# Altium schematic sheet PERIPHERALS.SchDoc: PERIPHERALS
size A3; Author: NGUYEN QUANG MINH; SheetNumber: 5; SheetTotal: 5; ProjectTitle: Arduino_DIY_V1.0
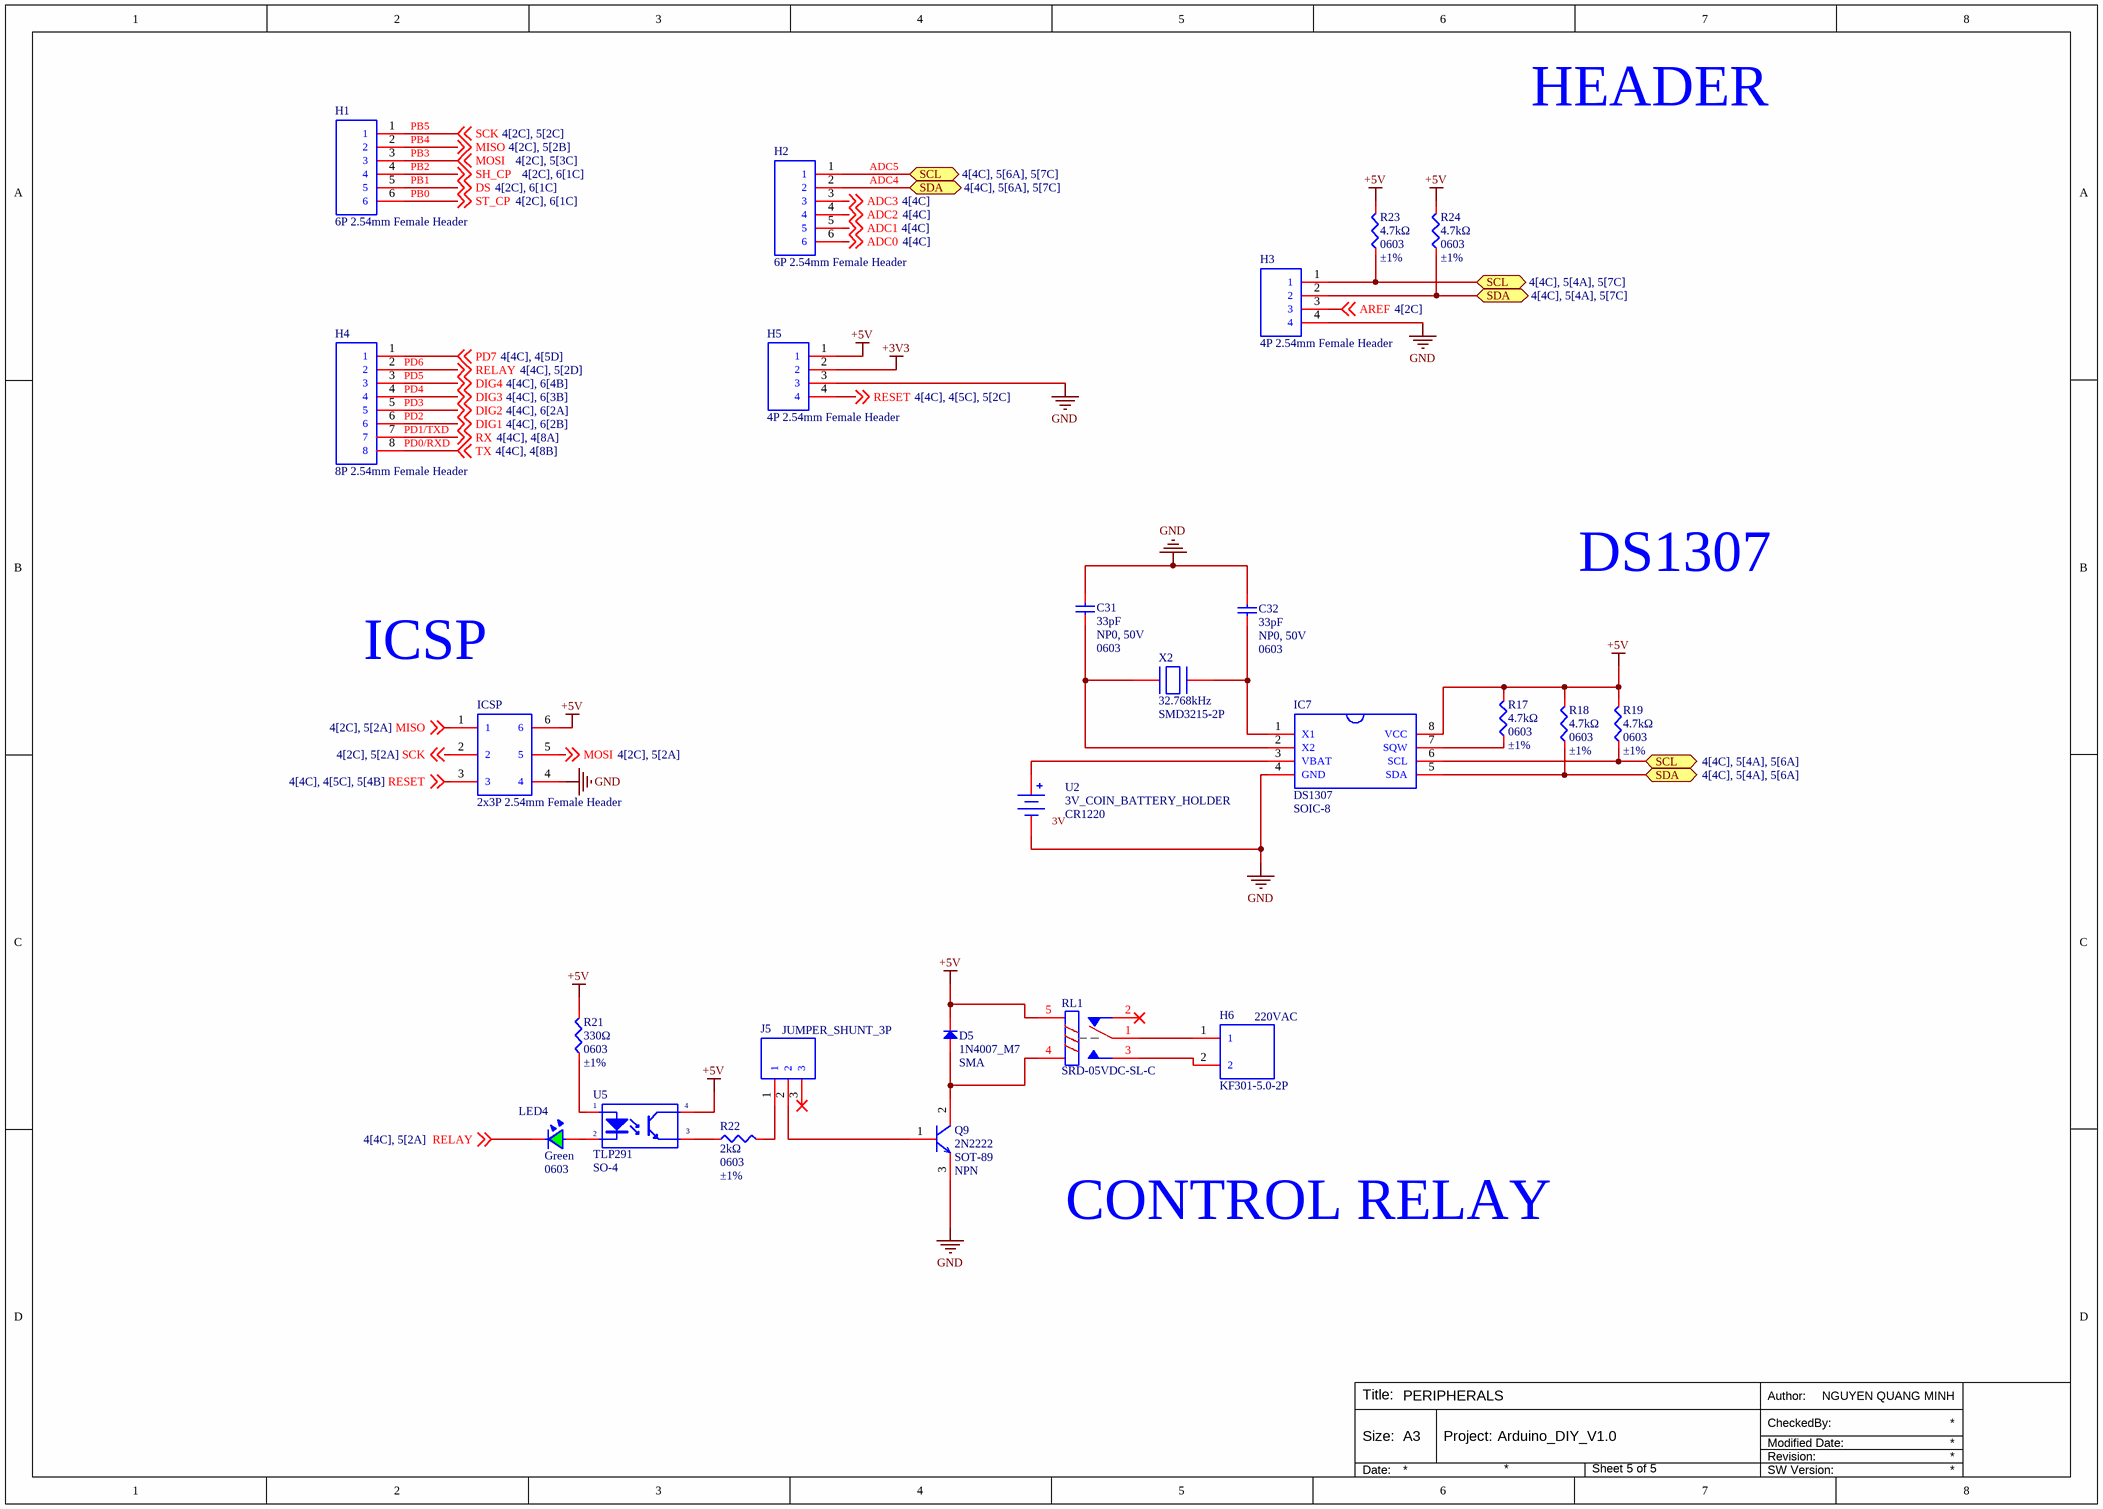
[diagram p0: PERIPHERALS.SchDoc]

## Parts
C31  33pF  Temperature Coefficient: NP0, 50V  Package: 0603  [C0603]
C32  33pF  Temperature Coefficient: NP0, 50V  Package: 0603  [C0603]
D5  1N4007_M7  Package: SMA  [SMA(DO-214AC)]
H1  6P 2.54mm Female Header  [6P, 2,54mm, FEMALE HEADER]
H2  6P 2.54mm Female Header  [6P, 2,54mm, FEMALE HEADER]
H3  4P 2.54mm Female Header  [4P, 2,54mm, FEMALE HEADER]
H4  8P 2.54mm Female Header  [8P, 2,54mm, FEMALE HEADER]
H5  4P 2.54mm Female Header  [4P, 2,54mm, FEMALE HEADER]
H6  KF301-5.0-2P  CONFIGURE: 220VAC  [CONN-TH_P5.00_KF301-5.0-2P]
IC7  DS1307  [SOIC-8]
ICSP  2x3P 2.54mm Female Header  [2x3P, 2.54mm, Female Header]
J5  JUMPER_SHUNT_3P  [JUMPER_SHUNT_3P]
LED4  Green  Package: 0603  [LED0603_GREEN]
Q9  2N2222  Package: SOT-89  Type: NPN  [SOT-89-3L]
R17  4.7kΩ  Package: 0603  Tolerance: ±1%  [R0603]
R18  4.7kΩ  Package: 0603  Tolerance: ±1%  [R0603]
R19  4.7kΩ  Package: 0603  Tolerance: ±1%  [R0603]
R21  330Ω  Package: 0603  Tolerance: ±1%  [R0603]
R22  2kΩ  Package: 0603  Tolerance: ±1%  [R0603]
R23  4.7kΩ  Package: 0603  Tolerance: ±1%  [R0603]
R24  4.7kΩ  Package: 0603  Tolerance: ±1%  [R0603]
RL1  SRD-05VDC-SL-C  [Through Hole,15.6x19.2mm]
U2  3V_COIN_BATTERY_HOLDER  Battery Type: CR1220  [3V_COIN_BATERRY_HOLDER_CR1220]
U5  TLP291  [SO-4]
X2  32.768kHz  [SMD3215-2P]

## Ports
SCL (bidir, see 4[4C], 5[4A], 5[6A]), SCL (bidir, see 4[4C], 5[4A], 5[7C]), SCL (bidir, see 4[4C], 5[6A], 5[7C]), SDA (bidir, see 4[4C], 5[4A], 5[6A]), SDA (bidir, see 4[4C], 5[4A], 5[7C]), SDA (bidir, see 4[4C], 5[6A], 5[7C])

## Nets
+3V3: H5.2
+5V: D5.1 H5.1 IC7.8(VCC) ICSP.6 R17.2 R18.2 R19.2 R21.2 R23.2 R24.2 RL1.5 U5.4(C)
GND: C31.2 C32.2 H3.4 H5.3 IC7.4(GND) ICSP.4 Q9.3(E) U2.2
ADC0: H2.6 ; off-sheet ADC0
ADC1: H2.5 ; off-sheet ADC1
ADC2: H2.4 ; off-sheet ADC2
ADC3: H2.3 ; off-sheet ADC3
AREF: H3.3 ; off-sheet AREF
DIG1: H4.6 ; off-sheet DIG1
DIG2: H4.5 ; off-sheet DIG2
DIG3: H4.4 ; off-sheet DIG3
DIG4: H4.3 ; off-sheet DIG4
DS: H1.5 ; off-sheet DS
MISO: H1.2 ICSP.1 ; off-sheet MISO
MOSI: H1.3 ICSP.5 ; off-sheet MOSI
PD7: H4.1 ; off-sheet PD7
RELAY: H4.2 LED4.2 ; off-sheet RELAY
RESET: H5.4 ICSP.3 ; off-sheet RESET
RX: H4.7 ; off-sheet RX
SCK: H1.1 ICSP.2 ; off-sheet SCK
SCL: H2.1 H3.1 IC7.6(SCL) R19.1 R23.1 ; port SCL
SDA: H2.2 H3.2 IC7.5(SDA) R18.1 R24.1 ; port SDA
SH_CP: H1.4 ; off-sheet SH_CP
ST_CP: H1.6 ; off-sheet ST_CP
TX: H4.8 ; off-sheet TX
NetC31_1: C31.1 IC7.2(X2) X2.2
NetC32_1: C32.1 IC7.1(X1) X2.1
NetD5_2: D5.2 Q9.2(C) RL1.4
NetH6_1: H6.1 RL1.1
NetH6_2: H6.2 RL1.3
NetIC7_3: IC7.3(VBAT) U2.1
NetIC7_7: IC7.7(SQW) R17.1
NetJ5_1: J5.1 R22.2
NetJ5_2: J5.2 Q9.1(B)
NetLED4_1: LED4.1 U5.2(K)
NetR21_1: R21.1 U5.1(A)
NetR22_1: R22.1 U5.3(E)

Not connected (* = marked no-connect by the designer): J5 3*; RL1 2*

## Notes on the sheet
- (near H1) PB1
- (near H1) PB2
- (near H1) PB3
- (near H1) PB4
- (near H1) PB5
- ADC4
- ADC5
- HEADER
- (near H1) PB0
- (near H4) PD5
- (near H4) PD6
- (near H4) PD0/RXD
- (near H4) PD1/TXD
- (near H4) PD2
- (near H4) PD3
- (near H4) PD4
- DS1307
- ICSP
- CONTROL RELAY
- Author:
- Title:
- Size:
- A3
- Project:
- Revision:
- Modified Date:
- CheckedBy:
- Date:
- SW Version:
- (in symbol 3V_COIN_BATTERY_HOLDER) 3V

## Library data of the parts
C31 C32 = C0603_MLCC_33pF_NP0_50V: 50V 33pF NP0 ±5% 0603 Multilayer Ceramic Capacitors MLCC - SMD/SMT ROHS; Manufacturer: YAGEO; Mfr. Part: CC0603JRNPO9BN330; LCSC Part: C107047; Capacitance: 33pF; Link: https://www.lcsc.com/product-detail/C107047.html; Tolerance: ±5%; Voltage Rating: 50V
D5 = 1N4007_M7: 1A 1V@1A 1kV SMA Diodes - General Purpose ROHS; Manufacturer: JSMSEMI; Mfr. Part: 1N4007 M7; LCSC Part: C20754788; Link: https://www.lcsc.com/product-detail/C20754788.html?s_z=n_1N4007
H1 H2 = 6P 2.54mm Female Header: 2.54mm 1 6P Through Hole 1x6P Through Hole,P=2.54mm Female Headers ROHS; Manufacturer: BOOMELE(Boom Precision Elec); Mfr. Part: 2.54-1*6P; LCSC Part: C40877; Package: Through Hole,P=2.54mm; Holes Structure: 1x6P; Link: https://www.lcsc.com/product-detail/C40877.html; Pitch: 2.54mm
H3 H5 = 4P 2.54mm Female Header: 2.54mm 1 3A 4P Bronze -40℃~+105℃ Through Hole 1x4P Top Square Hole Through Hole,P=2.54mm Female Headers ROHS; Manufacturer: BOOMELE(Boom Precision Elec); Mfr. Part: 2.54-1*4P; LCSC Part: C2718488; Package: Through Hole,P=2.54mm; Holes Structure: 1x4P; Link: https://www.lcsc.com/product-detail/C2718488.html; Pitch: 2.54mm
H4 = 8P 2.54mm Female Header: 2.54mm 1 8P Through Hole 1x8P Through Hole,P=2.54mm Female Headers ROHS; Manufacturer: BOOMELE(Boom Precision Elec); Mfr. Part: 2.54-1*8P; LCSC Part: C27438; Package: Through Hole,P=2.54mm; Holes Structure: 1x8P; Link: https://www.lcsc.com/product-detail/C27438.html; Pitch: 2.54mm
H6 = KF301-5.0-2P: 1x2P -30℃~+120℃ 17A 250V Blue 14~22 Through Hole 5mm 1.5 1 2 Through Hole,P=5mm Screw Terminal Blocks ROHS; Manufacturer: Cixi Kefa Elec; Mfr. Part: KF301-5.0-2P; LCSC Part: C474881; Package: Through Hole,P=5mm; Category: Connectors/Screw Terminal Blocks; Color: Blue; Link: https://www.lcsc.com/product-detail/C474881.html
IC7 = DS1307-SOIC8: I2C SOIC-8 Real Time Clocks ROHS; Manufacturer: MAXIM; Mfr. Part: DS1307Z+T&R; Key Attributes: 64 x 8, Serial, I²C Real-Time Clock; LCSC Part: C9868; Link: https://www.lcsc.com/product-detail/C9868.html?s_z=n_DS1307; Interface: I2C; Package: SOIC-8
ICSP = 2x3P 2.54mm Female Header: 2.54mm 2.54mm 3A 2 6P -40℃~+105℃ Through Hole 2x3P Top Square Hole Through Hole,P=2.54mm Female Headers ROHS; Manufacturer: HanElectricity; Mfr. Part: 2541FV-2x3P; LCSC Part: C18723054; Package: Through Hole,P=2.54mm; Holes Structure: 2x3P; Link: https://www.lcsc.com/product-detail/C18723054.html?s_z=n_HanElectricity%25202541FV-2x3P
J5 = JUMPER_SHUNT_3P: 250V 3A Through Hole Pin Header 2.5mm 3P 6mm -40℃~+105℃ 3mm 2.54mm 1 Black 1x3P Through Hole,P=2.54mm Pin Headers ROHS; Manufacturer: XFCN; Mfr. Part: PZ254V-11-03P; LCSC Part: C2937625; Package: Through Hole,P=2.54mm; Insulation Height: Insulation Height; Number of Rows: 1; Link: https://www.lcsc.com/product-detail/C2937625.html; Pin Structure: 1x3P
LED4 = LED0603_Green: 2mA 20mcd~50mcd Water Clear 525nm -40℃~+85℃ Green 130° 75mW 2.65V 0603 LED Indication - Discrete ROHS; Manufacturer: Kingbright; Mfr. Part: KPT-1608LVZGCK; Key Attributes: 1.6X0.8mm SMD CHIP LED LAMP; LCSC Part: C598356; Illumination Color: Green; Power(Watts): 75mW; Voltage - Forward(Vf): 2.65V; Forward Current: 2mA; Operating Temperature: -40℃~+85℃; Link: https://www.lcsc.com/product-detail/C598356.html
Q9 = 2N2222_SOT-89: 40V 500mW 600mA NPN SOT-89 Bipolar (BJT) ROHS; Manufacturer: CBI; Mfr. Part: 2N2222AU; Transition frequency(fT): 300MHz; Vce Saturation(VCE(sat)): 1V@500mA.50mA; LCSC Part: C21714170; Pd - Power Dissipation: 500mW; Current - Collector(Ic): 600mA; Link: https://www.lcsc.com/product-detail/C21714170.html?s_z=n_2N2222; Category: BJT
R17-R19 R23 R24 = R0603_4.7kΩ_±1%: 100mW Thick Film Resistor 75V ±100ppm/℃ ±1% 4.7kΩ 0603 Chip Resistor - Surface Mount ROHS; Manufacturer: YAGEO; Mfr. Part: RC0603FR-074K7L; LCSC Part: C99782; Resistance: 4.7kΩ; Operating Temperature: -55℃~+155℃; Link: https://www.lcsc.com/product-detail/C99782.html
R21 = R0603_330Ω_±1%: 100mW Thick Film Resistor 75V ±100ppm/℃ ±1% 330Ω 0603 Chip Resistor - Surface Mount ROHS; Manufacturer: YAGEO; Mfr. Part: RC0603FR-07330RL; LCSC Part: C105881; Resistance: 330Ω; Operating Temperature: -55℃~+155℃; Link: https://www.lcsc.com/product-detail/C105881.html
R22 = R0603_2kΩ_±1%: 100mW Thick Film Resistor 75V ±100ppm/℃ ±1% 2kΩ 0603 Chip Resistor - Surface Mount ROHS; Manufacturer: YAGEO; Mfr. Part: RC0603FR-072KL; LCSC Part: C105576; Resistance: 2kΩ; Operating Temperature: -55℃~+155℃; Link: https://www.lcsc.com/product-detail/C105576.html
RL1 = SRD-05VDC-SL-C: 250V@AC 5V 15A 1 Form C: 1C (SPDT-CO) Through Hole,15.6x19.2mm Power Relays ROHS; Manufacturer: Songle Relay; Mfr. Part: SRD-05VDC-SL-C; LCSC Part: C35449; Package: Through Hole,15.6x19.2mm; Switching Voltage(Max): 250V@AC; Coil Voltage: 5V; Switching Current(Max): 15A; Number of Pins: 5; Link: https://www.lcsc.com/product-detail/C35449.html?s_z=n_relay
U2 = 3V_COIN_BATTERY_HOLDER: Battery Holder -25℃~+85℃ Phosphor Bronze CR1220 SMD Button And Strip Battery Connector ROHS; Manufacturer: MYOUNG; Mfr. Part: BS-12-B3AA003; LCSC Part: C964723; Package: SMD; Link: https://www.lcsc.com/product-detail/C964723.html
U5 = TLP291: SO-4 Transistor, Photovoltaic Output Optoisolators ROHS; Manufacturer: TOSHIBA; Mfr. Part: TLP291(GB-TP,SE(T; LCSC Part: C5255297; Package: SO-4
X2 = Crystal_32.768Khz: 32.768kHz 12.5pF ±20ppm SMD3215-2P Crystals ROHS; Manufacturer: NDK; Mfr. Part: NX3215SA-32.768K-STD-MUA-8; LCSC Part: C156245; Frequency: 32.768kHz; Type: -; Load Capacitance: 12.5pF; Frequency Stability: -; Operating Temperature: -40℃~+85℃; Link: https://www.lcsc.com/product-detail/C156245.html?s_z=n_Crystal%252032%252C768kHz; Package: SMD3215-2P